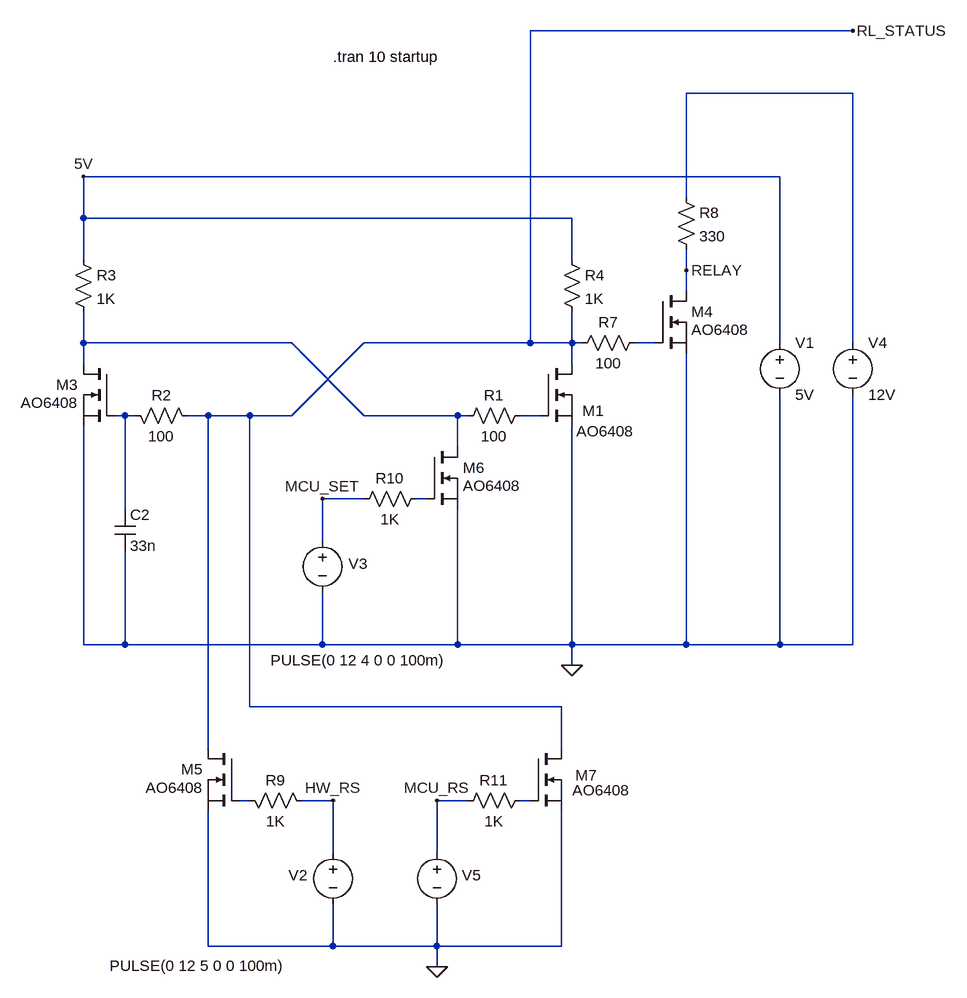
[diagram p0: schematic OVP_latch.asc]
OVP_latch.asc, the LTspice schematic file:
Version 4
SHEET 1 1220 1128
WIRE 928 -368 432 -368
WIRE 928 -272 672 -272
WIRE 816 -144 -256 -144
WIRE 672 -112 672 -272
WIRE -256 -80 -256 -144
WIRE 496 -80 -256 -80
WIRE -256 -16 -256 -80
WIRE 496 -16 496 -80
WIRE 672 0 672 -32
WIRE 672 32 672 0
WIRE -256 112 -256 64
WIRE 64 112 -256 112
WIRE 432 112 432 -368
WIRE 432 112 176 112
WIRE 496 112 496 64
WIRE 496 112 432 112
WIRE 512 112 496 112
WIRE 624 112 592 112
WIRE 816 112 816 -144
WIRE 928 112 928 -272
WIRE -256 144 -256 112
WIRE 496 144 496 112
WIRE -192 224 -208 224
WIRE -176 224 -192 224
WIRE -64 224 -96 224
WIRE 0 224 -64 224
WIRE 64 224 176 112
WIRE 64 224 0 224
WIRE 176 224 64 112
WIRE 320 224 176 224
WIRE 336 224 320 224
WIRE 448 224 416 224
WIRE 320 272 320 224
WIRE 176 352 112 352
WIRE 272 352 256 352
WIRE -192 368 -192 224
WIRE 112 416 112 352
WIRE -256 576 -256 240
WIRE -192 576 -192 432
WIRE -192 576 -256 576
WIRE 112 576 112 496
WIRE 112 576 -192 576
WIRE 320 576 320 368
WIRE 320 576 112 576
WIRE 496 576 496 240
WIRE 496 576 320 576
WIRE 672 576 672 128
WIRE 672 576 496 576
WIRE 816 576 816 192
WIRE 816 576 672 576
WIRE 928 576 928 192
WIRE 928 576 816 576
WIRE 496 608 496 576
WIRE 0 672 0 224
WIRE 480 672 0 672
WIRE -64 736 -64 224
WIRE 480 736 480 672
WIRE 0 816 -16 816
WIRE 128 816 80 816
WIRE 336 816 288 816
WIRE 432 816 416 816
WIRE 128 896 128 816
WIRE 288 896 288 816
WIRE -64 1040 -64 832
WIRE 128 1040 128 976
WIRE 128 1040 -64 1040
WIRE 288 1040 288 976
WIRE 288 1040 128 1040
WIRE 480 1040 480 832
WIRE 480 1040 288 1040
WIRE 288 1072 288 1040
FLAG 496 608 0
FLAG 672 0 RELAY
FLAG -256 -144 5V
FLAG 928 -368 RL_STATUS
FLAG 288 1072 0
FLAG 288 816 MCU_RS
FLAG 128 816 HW_RS
FLAG 112 352 MCU_SET
SYMBOL nmos 448 144 R0
WINDOW 0 64 72 Left 2
WINDOW 3 55 104 Left 2
SYMATTR InstName M1
SYMATTR Value AO6408
SYMBOL res 432 208 R90
WINDOW 0 0 56 VBottom 2
WINDOW 3 32 56 VTop 2
SYMATTR InstName R1
SYMATTR Value 100
SYMBOL nmos -208 144 M0
WINDOW 3 56 60 Left 2
SYMATTR Value AO6408
SYMATTR InstName M3
SYMBOL res -192 208 M90
WINDOW 0 0 56 VBottom 2
WINDOW 3 32 56 VTop 2
SYMATTR InstName R2
SYMATTR Value 100
SYMBOL res -272 -32 R0
SYMATTR InstName R3
SYMATTR Value 1K
SYMBOL res 480 -32 R0
SYMATTR InstName R4
SYMATTR Value 1K
SYMBOL voltage 816 96 R0
WINDOW 123 0 0 Left 0
WINDOW 39 0 0 Left 0
SYMATTR InstName V1
SYMATTR Value 5V
SYMBOL nmos 624 32 R0
WINDOW 3 56 60 Left 2
SYMATTR Value AO6408
SYMATTR InstName M4
SYMBOL res 608 96 R90
WINDOW 0 0 56 VBottom 2
WINDOW 3 32 56 VTop 2
SYMATTR InstName R7
SYMATTR Value 100
SYMBOL nmos -16 736 M0
WINDOW 3 56 60 Left 2
SYMATTR Value AO6408
SYMATTR InstName M5
SYMBOL res -16 800 M90
WINDOW 0 0 56 VBottom 2
WINDOW 3 32 56 VTop 2
SYMATTR InstName R9
SYMATTR Value 1K
SYMBOL nmos 272 272 R0
WINDOW 3 56 60 Left 2
SYMATTR Value AO6408
SYMATTR InstName M6
SYMBOL res 272 336 R90
WINDOW 0 0 56 VBottom 2
WINDOW 3 32 56 VTop 2
SYMATTR InstName R10
SYMATTR Value 1K
SYMBOL voltage 128 880 R0
WINDOW 0 -68 51 Left 2
WINDOW 3 -344 190 Left 2
WINDOW 123 0 0 Left 0
WINDOW 39 0 0 Left 0
SYMATTR InstName V2
SYMATTR Value PULSE(0 12 5 0 0 100m)
SYMBOL voltage 112 400 R0
WINDOW 0 40 52 Left 2
WINDOW 3 -80 200 Left 2
WINDOW 123 0 0 Left 0
WINDOW 39 0 0 Left 0
SYMATTR InstName V3
SYMATTR Value PULSE(0 12 4 0 0 100m)
SYMBOL res 656 -128 R0
SYMATTR InstName R8
SYMATTR Value 330
SYMBOL voltage 928 96 R0
WINDOW 123 0 0 Left 0
WINDOW 39 0 0 Left 0
SYMATTR InstName V4
SYMATTR Value 12V
SYMBOL nmos 432 736 R0
WINDOW 0 69 41 Left 2
WINDOW 3 65 64 Left 2
SYMATTR InstName M7
SYMATTR Value AO6408
SYMBOL res 432 800 R90
WINDOW 0 0 56 VBottom 2
WINDOW 3 32 56 VTop 2
SYMATTR InstName R11
SYMATTR Value 1K
SYMBOL voltage 288 880 M0
WINDOW 0 -68 51 Left 2
WINDOW 3 -426 190 Left 2
WINDOW 123 0 0 Left 0
WINDOW 39 0 0 Left 0
SYMATTR InstName V5
SYMATTR Value ""
SYMBOL cap -208 368 R0
SYMATTR InstName C2
SYMATTR Value 33n
TEXT 128 -328 Left 2 !.tran 10 startup

The netlist it stands for:
* OVP_latch.asc
M1 RL_STATUS N005 0 0 AO6408
R1 N005 N002 100
M3 N002 N004 0 0 AO6408
R2 N004 RL_STATUS 100
R3 5V N002 1K
R4 5V RL_STATUS 1K
V1 5V 0 5V
M4 RELAY N003 0 0 AO6408
R7 N003 RL_STATUS 100
M5 RL_STATUS N007 0 0 AO6408
R9 N007 HW_RS 1K
M6 N002 N006 0 0 AO6408
R10 N006 MCU_SET 1K
V2 HW_RS 0 PULSE(0 12 5 0 0 100m)
V3 MCU_SET 0 PULSE(0 12 4 0 0 100m)
R8 N001 RELAY 330
V4 N001 0 12V
M7 RL_STATUS N008 0 0 AO6408
R11 N008 MCU_RS 1K
V5 MCU_RS 0
C2 N004 0 33n
.model NMOS NMOS
.model PMOS PMOS
.lib standard.mos
.tran 10 startup
.backanno
.end